# Altium schematic sheet Sheet2.SchDoc
size A
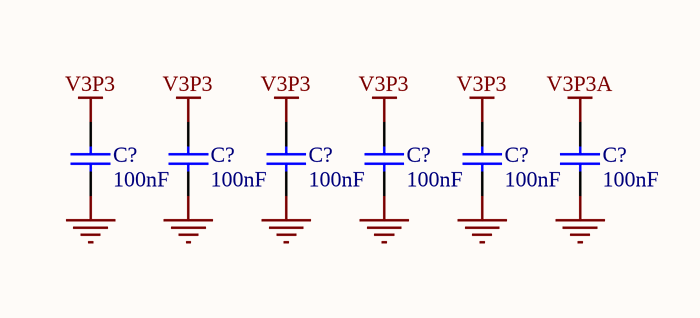
[diagram p0: Sheet2.SchDoc]

## Parts
(Parts that share a designator on the sheet are numbered #1, #2 ... from top to bottom, then left to right.)
C?#1  100nF  [RAD-0.3]
C?#2  100nF  [RAD-0.3]
C?#3  100nF  [RAD-0.3]
C?#4  100nF  [RAD-0.3]
C?#5  100nF  [RAD-0.3]
C?#6  100nF  [RAD-0.3]

## Nets
GND: C?#1.1 C?#2.1 C?#3.1 C?#4.1 C?#5.1 C?#6.1
V3P3: C?#1.2 C?#2.2 C?#3.2 C?#4.2 C?#5.2
V3P3A: C?#6.2

## Library data of the parts
C?#1-C?#6 = Cap: Capacitor; Published: 8-Jun-2000; LatestRevisionDate: 17-Jul-2002; LatestRevisionNote: Re-released for DXP Platform.; PackageReference: RAD-0.3; Publisher: Altium Limited; PackageDescription: Radial Cap, Thru-Hole; 2 Leads; 0.3 in Pin Spacing; Value: 100nF